# EAGLE schematic RAMPSdisplay (EAGLE 6.2)
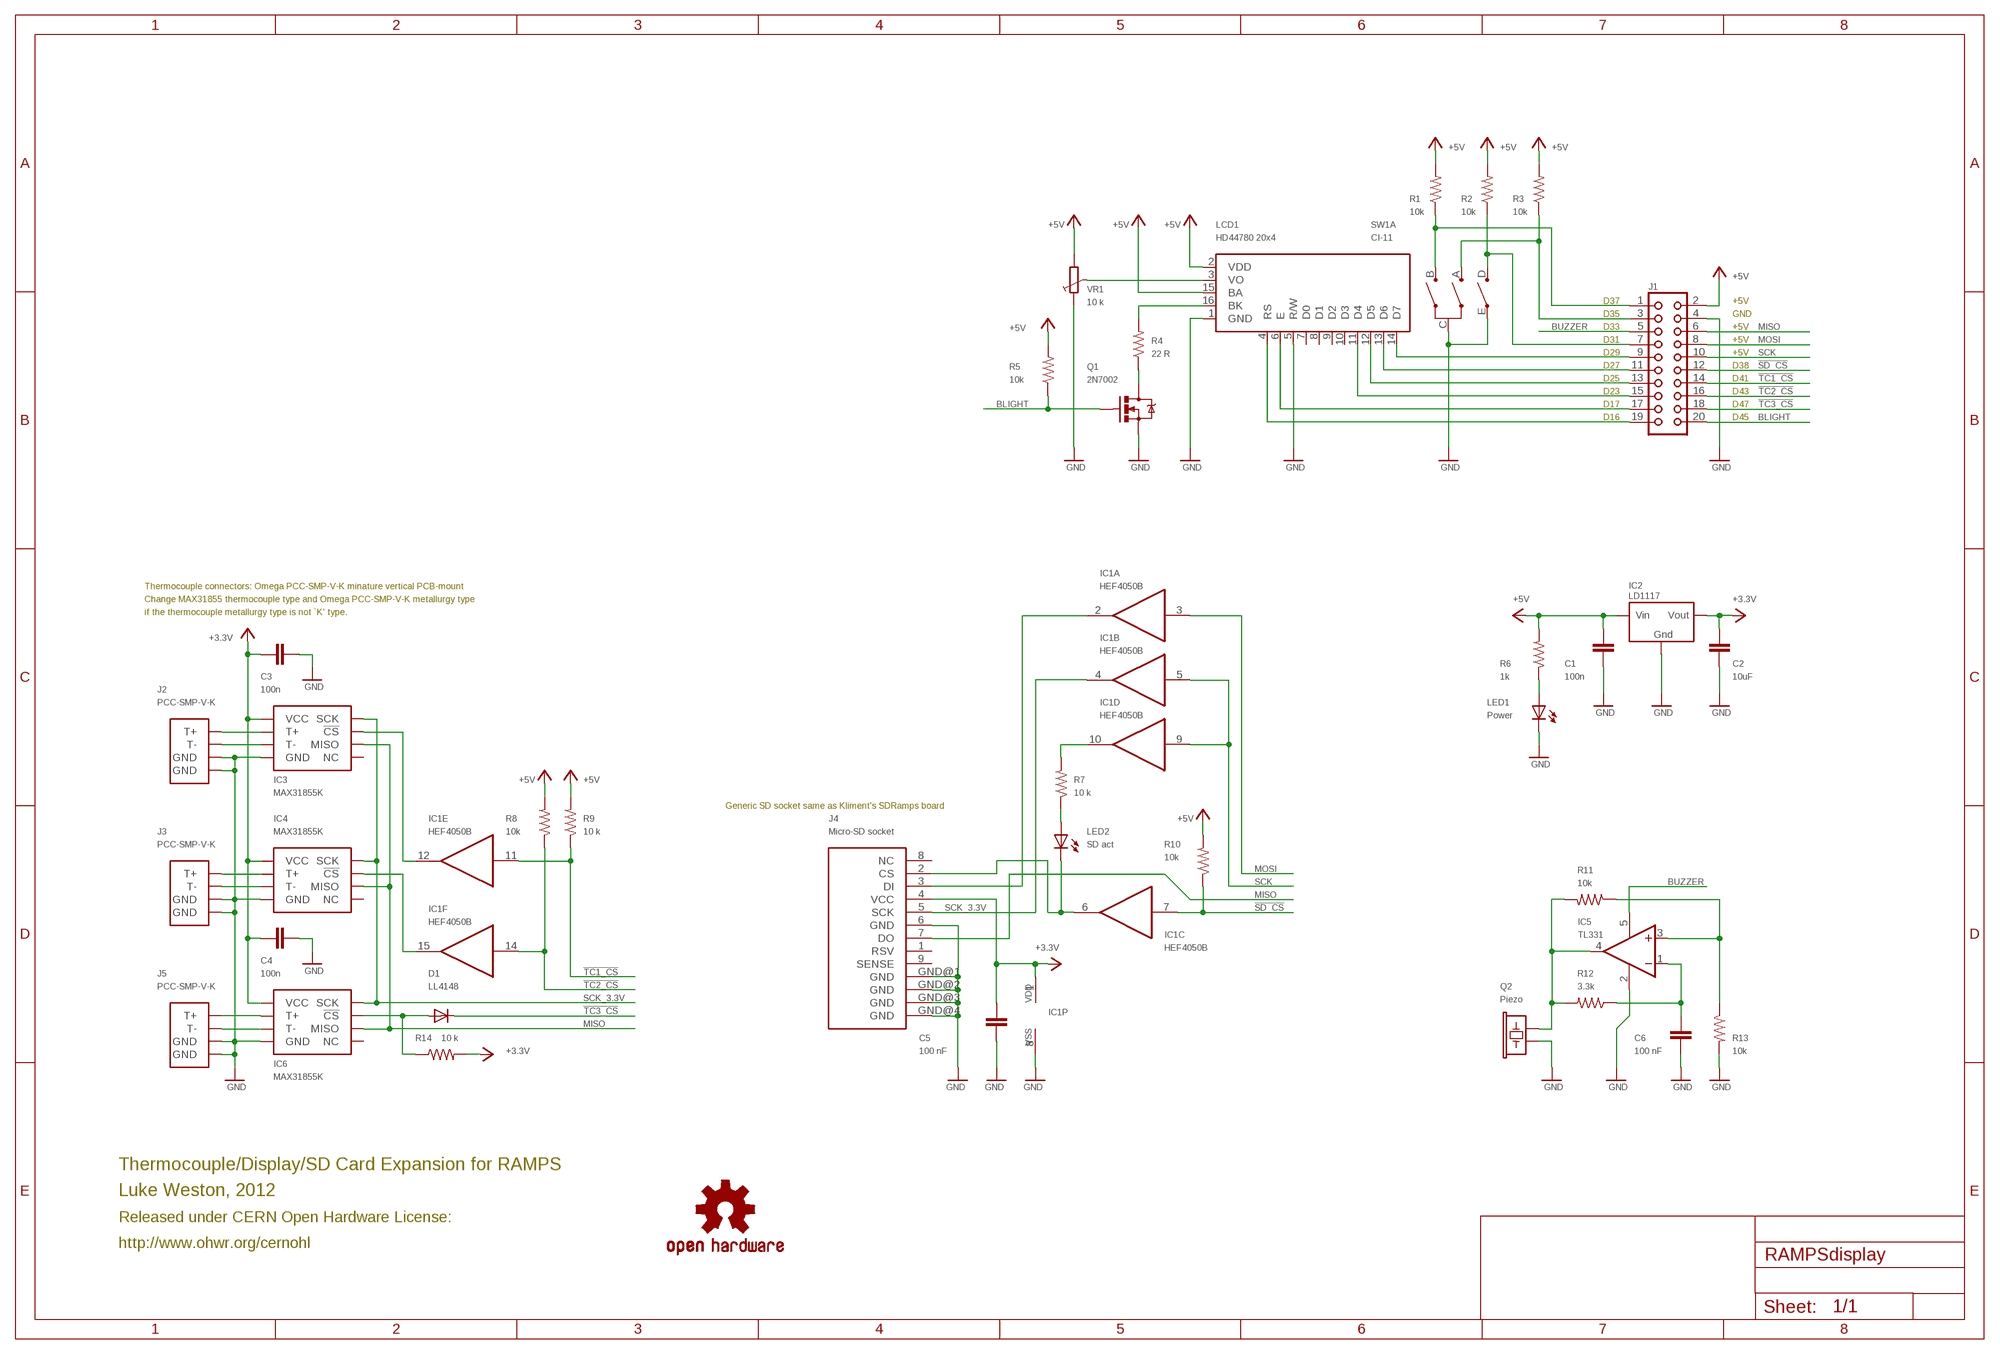
[diagram p0: schematic, sheet 1]

## Parts
C1  100n  C-EUC0805K  [C0805K]
C2  10uF  C-EUC0805K  [C0805K]
C3  100n  C-EUC0805K  [C0805K]
C4  100n  C-EUC0805K  [C0805K]
C5  100 nF  C-EUC0805K  [C0805K]
C6  100 nF  C-EUC0805K  [C0805K]
D1  LL4148  DIODE-SOD80C  [SOD80C]
IC1  HEF4050B  4050D  [SO16]
IC2  LD1117  REG1117  [SOT223]
IC3  MAX31855K  MCLENG_MAX6675MAX31855  [MCLENG_SOIC-8]
IC4  MAX31855K  MCLENG_MAX6675MAX31855  [MCLENG_SOIC-8]
IC5  TL331  [DBV-R-PDSO-G5]
IC6  MAX31855K  MCLENG_MAX6675MAX31855  [MCLENG_SOIC-8]
J1  CON20  [CON20]
J2  PCC-SMP-V-K  MCLAUGHLINENG_TC_JACK  [MCLAUGHLINENG_TC_JACK]
J3  PCC-SMP-V-K  MCLAUGHLINENG_TC_JACK  [MCLAUGHLINENG_TC_JACK]
J4  Micro-SD socket  MICROSD_PP  [MICROSD_PP]
J5  PCC-SMP-V-K  MCLAUGHLINENG_TC_JACK  [MCLAUGHLINENG_TC_JACK]
LCD1  HD44780 20x4  HDM20416L  [HDM20416L]
LED1  Power  LEDCHIPLED_0805  [CHIPLED_0805]
LED2  SD act  LEDCHIPLED_0805  [CHIPLED_0805]
Q1  2N7002  MOSFET-NCHANNELSMD  [SOT23-3]
Q2  Piezo  FREETRONICS-MASTER-V1_BUZZERSMD12X12  [FREETRONICS-MASTER-V1_BUZZER-12X12-SMT]
R1  10k  R-US_M0805  [M0805]
R2  10k  R-US_M0805  [M0805]
R3  10k  R-US_M0805  [M0805]
R4  22 R  R-US_M0805  [M0805]
R5  10k  R-US_M0805  [M0805]
R6  1k  R-US_M0805  [M0805]
R7  10 k  R-US_M0805  [M0805]
R8  10k  R-US_M0805  [M0805]
R9  10 k  R-US_M0805  [M0805]
R10  10k  R-US_M0805  [M0805]
R11  10k  R-US_M0805  [M0805]
R12  3.3k  R-US_M0805  [M0805]
R13  10k  R-US_M0805  [M0805]
R14  10 k  R-US_M0805  [M0805]
SW1  CI-11  [CI-11]
U$  OSHW-LOGOS  [OSHW-LOGO-S]
VR1  10 k  TRIM_EU-CT6  [CT6]

## Nets
!SD_CS: IC1.7(C:I) J1.12 R10.1
!TC1_CS: IC1.11(E:I) J1.14 R9.1
!TC2_CS: IC1.14(F:I) J1.16 R8.1
!TC3_CS: D1.C J1.18
+3V3: C2.1 C3.1 C4.1 C5.1 IC1.1(P:VDD) IC2.2(VOUT) IC3.VCC IC4.VCC IC6.VCC J4.4(VCC) R14.2 ; supply symbol labelled +3.3V
+5V: C1.1 IC2.3(VIN) J1.2 LCD1.2(VDD) LCD1.15(BA) R1.2 R2.2 R3.2 R5.2 R6.2 R8.2 R9.2 R10.2 VR1.A
BF: IC1.12(E:O) IC3.CS(!CS)
BLIGHT: J1.20 Q1.1(G) R5.1
BUZZER: IC5.5(V+) J1.5
FOO: IC1.6(C:O) J4.2(CS) LED2.C
GND: C1.2 C2.2 C3.2 C4.2 C5.2 C6.2 IC1.8(P:VSS) IC2.1(GND) IC3.GND IC4.GND IC5.2(GND) IC6.GND J1.4 J2.P$1(GND) J2.P$2(GND) J3.P$1(GND) J3.P$2(GND) J4.6(GND) J4.GND@1(GND) J4.GND@2(GND) J4.GND@3(GND) J4.GND@4(GND) J5.P$1(GND) J5.P$2(GND) LCD1.1(GND) LCD1.5(R/W) LED1.C Q1.2(S) Q2.1 R13.2 SW1.C(A:C) SW1.E(B:E) VR1.E
MISO: IC3.SO(MISO) IC4.SO(MISO) IC6.SO(MISO) J1.6 J4.7(DO)
MOSI: IC1.3(A:I) J1.8
MOSI_3.3V: IC1.2(A:O) J4.3(DI)
N$1: LCD1.3(VO) VR1.S
N$2: LCD1.16(BK) R4.2
N$3: J1.7 R2.1 SW1.D(B:D)
N$4: J1.9 LCD1.14(D7)
N$5: J1.11 LCD1.13(D6)
N$6: J1.13 LCD1.12(D5)
N$7: J1.15 LCD1.11(D4)
N$8: J1.17 LCD1.6(E)
N$9: J1.19 LCD1.4(RS)
N$10: IC6.T+ J5.T+
N$11: J1.3 R3.1 SW1.A(A:A)
N$12: J1.1 R1.1 SW1.B(A:B)
N$13: IC6.T- J5.T-
N$14: Q1.3(D) R4.1
N$15: IC4.T- J3.T-
N$16: D1.A IC6.CS(!CS) R14.1
N$17: IC4.T+ J3.T+
N$18: IC3.T- J2.T-
N$19: IC3.T+ J2.T+
N$20: IC1.15(F:O) IC4.CS(!CS)
N$22: LED2.A R7.1
N$25: IC1.10(D:O) R7.2
N$30: C6.1 IC5.1(-IN) R12.1
N$31: IC5.3(+IN) R11.1 R13.1
N$34: IC5.4(OUT) Q2.2 R11.2 R12.2
N$75: LED1.A R6.1
SCK: IC1.5(B:I) IC1.9(D:I) J1.10
SCK_3.3V: IC1.4(B:O) IC3.SCK IC4.SCK IC6.SCK J4.5(SCK)
Unconnected: IC3.NC IC4.NC IC6.NC J4.1(RSV) J4.8(NC) J4.9(SENSE) LCD1.7(D0) LCD1.8(D1) LCD1.9(D2) LCD1.10(D3)

## Notes on the sheet
- D37 | +5V
- D35 | GND
- D33 | +5V
- D31 | +5V
- D29 | +5V
- D27 | D38
- D25 | D41
- D23 | D43
- D17 | D47
- D16 | D45
- Thermocouple connectors: Omega PCC-SMP-V-K minature vertical PCB-mount
- Change MAX31855 thermocouple type and Omega PCC-SMP-V-K metallurgy type
- if the thermocouple metallurgy type is not `K' type.
- Generic SD socket same as Kliment's SDRamps board
- Thermocouple/Display/SD Card Expansion for RAMPS
- Luke Weston, 2012
- Released under CERN Open Hardware License:
- http://www.ohwr.org/cernohl

## Library data of the parts
C1-C6 = rcl:C-EU: CAPACITOR, European symbol
D1 = diode:DIODE-: DIODE
IC1 = 40xx:4050: Hex non-inverting BUFFER
IC2 = burr-brown:REG1117: 800mA and 1A Low Dropout (LDO) Positive Regulator 1.8V, 2.5V, 2.85V, 3.3V, 5V, and Adj; MPN: REG1117; OC_FARNELL: 1097566; OC_NEWARK: 14P6981
IC3 IC4 IC6 = RAMPSdisplay:MCLENG_MAX6675
IC5 = linear:TL331: SINGLE DIFFERENTIAL COMPARATOR Source: http://www.ti.com .. tl331.pdf
J1 = con-harting:CON20: CONNECTOR; OC_FARNELL: unknown; OC_NEWARK: unknown
J2 J3 J5 = RAMPSdisplay:MCLAUGHLINENG_TC_JACK
J4 = DE1594:MICROSD_PP
LCD1 = abi-lcd:HDM20416L
LED1 LED2 = led:LED: LED OSRAM: - CHIPLED LG R971, LG N971, LY N971, LG Q971, LY Q971, LO R971, LY R971 LH N974, LH R974 LS Q976, LO Q976, LY Q976 LO Q996 - Hyper CHIPLED LW Q18S LB Q993, LB Q99A, LB R99A - SideLED LS A670, LO A670, LY A670, LG A670, LP A670 LB A673, LV A673, LT A673, LW A673 LH A674 LY A675 LS A676, LA A676, LO A676, LY A676, LW A676 LS A679, LY A679, LG A679 - Hyper Micro SIDELED® LS Y876, LA Y876, LO Y876, LY Y876 LT Y87S - SmartLED LW L88C, LW L88S LB L89C, LB L89S, LG L890 LS L89K, LO L89K, LY L89K LS L896, LA L896, LO L896, LY L896 - TOPLED LS T670, LO T670, LY T670, LG T670, LP T670 LSG T670, LSP T670, LSY T670, LOP T670, LYG T670 LG T671, LOG T671, LSG T671 LB T673, LV T673, LT T673, LW T673 LH T674 LS T676, LA T676, LO T676, LY T676, LB T676, LH T676, LSB T676, LW T676 LB T67C, LV T67C, LT T67C, LS T67K, LO T67K, LY T67K, LW E67C LS E67B, LA E67B, LO E67B, LY E67B, LB E67C, LV E67C, LT E67C LW T67C LS T679, LY T679, LG T679 LS T770, LO T770, LY T770, LG T770, LP T770 LB T773, LV T773, LT T773, LW T773 LH T774 LS E675, LA E675, LY E675, LS T675 LS T776, LA T776, LO T776, LY T776, LB T776 LHGB T686 LT T68C, LB T68C - Hyper Mini TOPLED® LB M676 - Mini TOPLED Santana® LG M470 LS M47K, LO M47K, LY M47K Source: http://www.osram.convergy.de LUXEON: - LUMILED® LXK2-PW12-R00, LXK2-PW12-S00, LXK2-PW14-U00, LXK2-PW14-V00 LXK2-PM12-R00, LXK2-PM12-S00, LXK2-PM14-U00 LXK2-PE12-Q00, LXK2-PE12-R00, LXK2-PE12-S00, LXK2-PE14-T00, LXK2-PE14-U00 LXK2-PB12-K00, LXK2-PB12-L00, LXK2-PB12-M00, LXK2-PB14-N00, LXK2-PB14-P00, LXK2-PB14-Q00 LXK2-PR12-L00, LXK2-PR12-M00, LXK2-PR14-Q00, LXK2-PR14-R00 LXK2-PD12-Q00, LXK2-PD12-R00, LXK2-PD12-S00 LXK2-PH12-R00, LXK2-PH12-S00 LXK2-PL12-P00, LXK2-PL12-Q00, LXK2-PL12-R00 Source: www.luxeon.com KINGBRIGHT: KA-3528ASYC Source: www.kingbright.com
Q1 = freetronics-master-v1:MOSFET-NCHANNEL
Q2 = RAMPSdisplay:FREETRONICS-MASTER-V1_BUZZER: Buzzer - Piezo Transducer
R1-R14 = rcl:R-US_: RESISTOR, American symbol
SW1 = piher:CI-11: 11mm Incemental Encoder Source: www.piher.net .. 04-CI-11v04.pdf; OC_FARNELL: unknown; OC_NEWARK: unknown
U$ = SparkFun:OSHW-LOGO: Open Source Hardware Logo This logo indicates the piece of hardware it is found on incorporates a OSHW license and/or adheres to the definition of open source hardware found here: http://freedomdefined.org/OSHW
VR1 = pot:TRIM_EU-: POTENTIOMETER